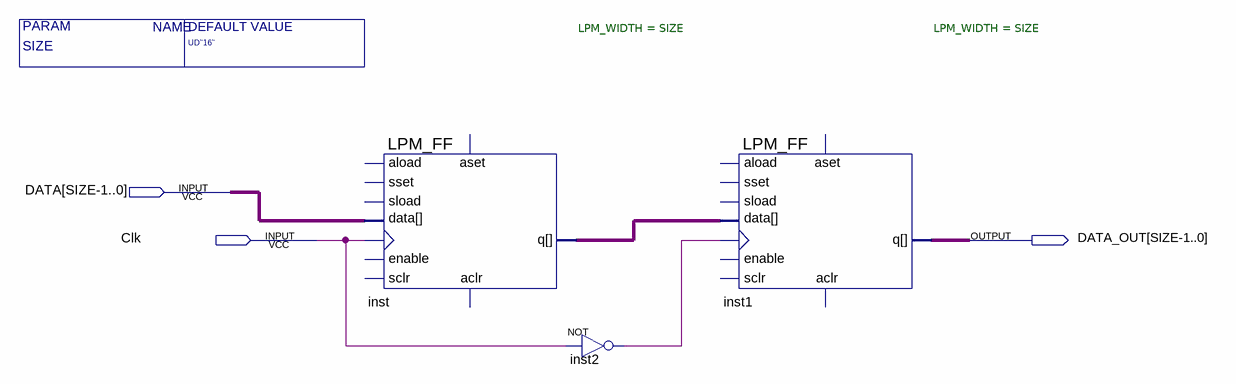
[diagram p0: schematic sheet]
// Quartus schematic SynchRegister.bdf as structural Verilog: 3 symbols, 3 pins
module SynchRegister #(parameter SIZE = "UD\"16\"") (
  input  \DATA[SIZE-1..0] ,
  input  Clk,
  output \DATA_OUT[SIZE-1..0] 
);

  wire inst2_out, inst_q;

  LPM_FF #(.LPM_WIDTH(SIZE)) inst (
    .clock(Clk), .data(\DATA[SIZE-1..0] ), .q(inst_q));  // open: enable, aload, sset, sload, aset, sclr, aclr
  not inst2 (inst2_out, Clk);
  LPM_FF #(.LPM_WIDTH(SIZE)) inst1 (
    .clock(inst2_out), .data(inst_q), .q(\DATA_OUT[SIZE-1..0] ));  // open: enable, aload, sset, sload, aset, sclr, aclr
endmodule
